# Altium schematic sheet ADC-Peripherals.SchDoc: <SPECIFIC SHEET FUNCTION>
size A3; Date: DO NOT USE, RATHER USE PROJ OPTIONS; DrawnBy: DO NOT USE, RATHER USE PROJ OPTIONS; Engineer: DO NOT USE, RATHER USE PROJ OPTIONS; Organization: DO NOT USE, RATHER USE PROJ OPTIONS; DocumentNumber: 5; Revision: DO NOT USE, RATHER USE PROJ OPTIONS; SheetNumber: 5; SheetTotal: 12; SCH_Sheet_Filename: ADC-Peripherals.SchDoc; CurrentTime: DO NOT USE, RATHER USE PROJ OPTIONS; Time: DO NOT USE, RATHER USE PROJ OPTIONS; DocumentFullPathAndName: DO NOT USE, RATHER USE PROJ OPTIONS; DocumentName: DO NOT USE, RATHER USE PROJ OPTIONS; ModifiedDate: DO NOT USE, RATHER USE PROJ OPTIONS; ImagePath: DO NOT USE, RATHER USE PROJ OPTIONS
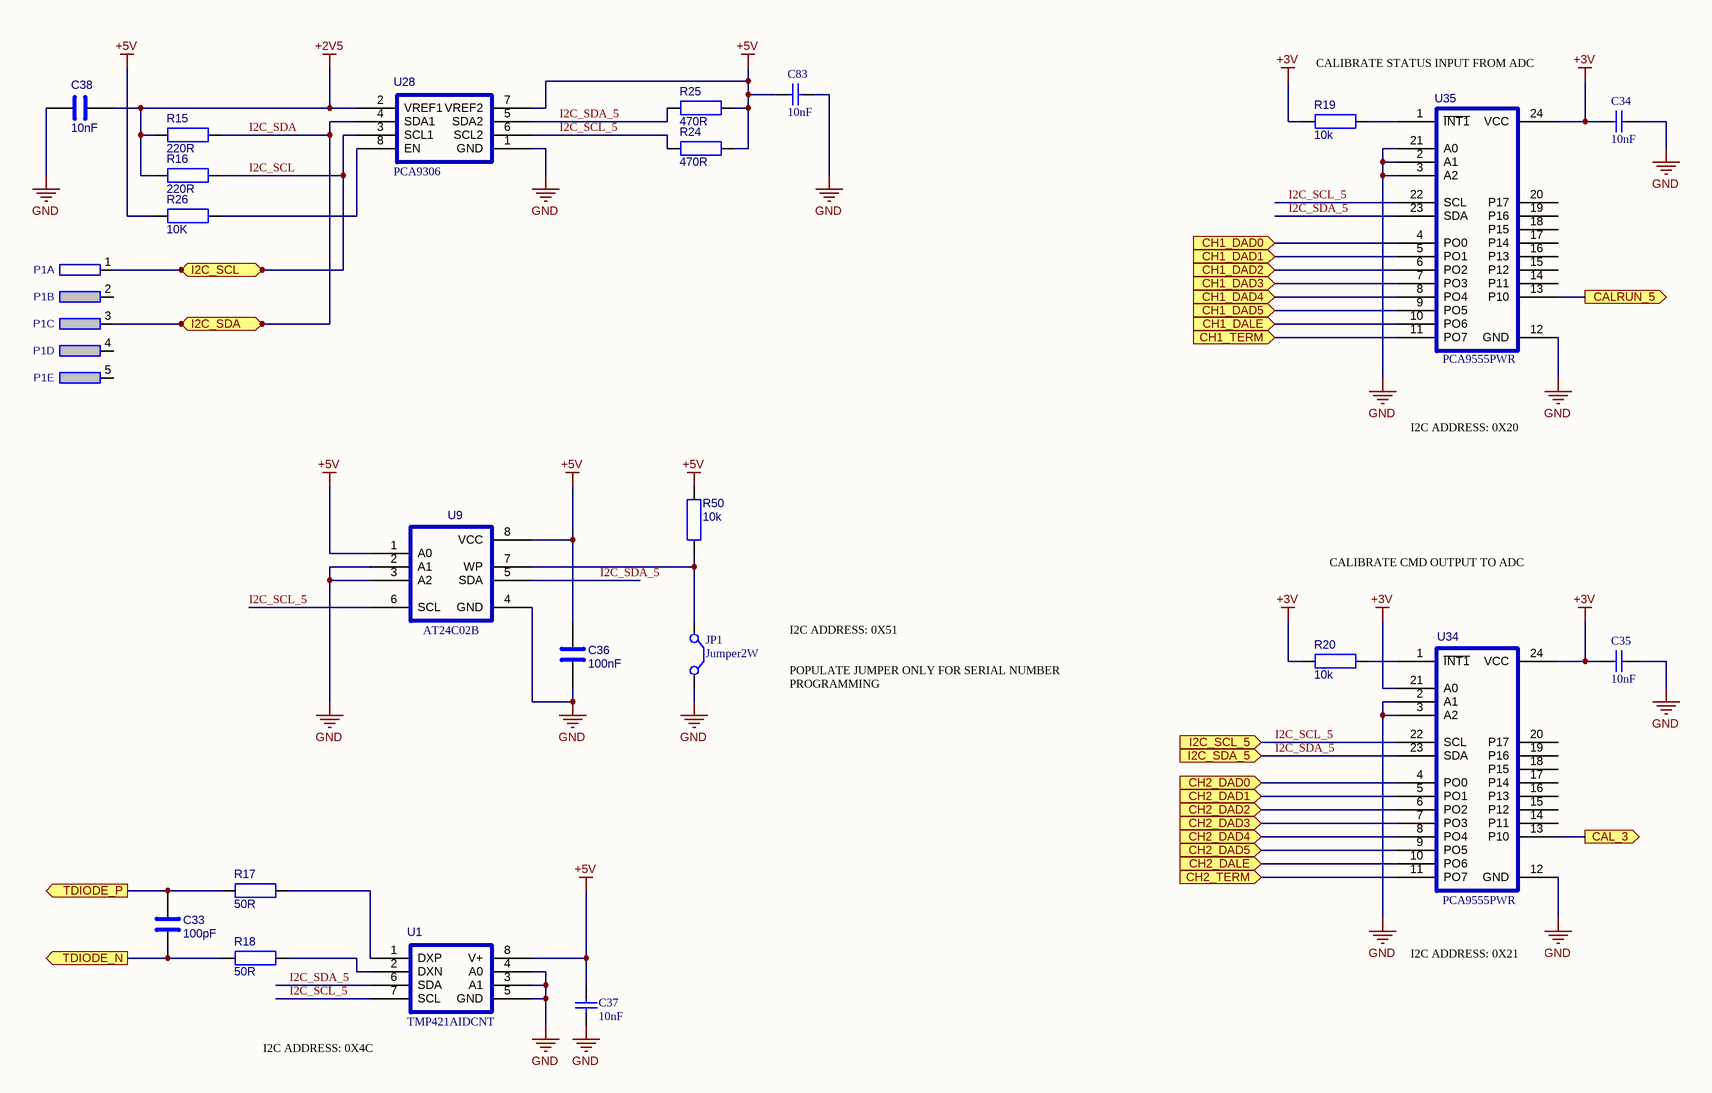
[diagram p0: ADC-Peripherals.SchDoc]

## Parts
C33  value 100pF  [CAPC1005X55N]  (hidden comment: *)
C34  value 10nF  [CAPC1005X55N]  (hidden comment: Capacitor 0402 SMD)
C35  value 10nF  [CAPC1005X55N]  (hidden comment: Capacitor 0402 SMD)
C36  100nF  [CAPC1005X55N]
C37  value 10nF  [CAPC1005X55N]  (hidden comment: Capacitor 0402 SMD)
C38  10nF  [CAPC1005X55N]
C83  value 10nF  [CAPC1005X55N]  (hidden comment: Capacitor 0402 SMD)
JP1  Jumper2W  [JP-100MIL]
P1  SAMTEC-TSM-105-01-TM-SV-5W-HDR  [TSM_5X1_SV]  (value not drawn)  (parts A,B,C,D,E of 5)
R15  220R  [0603]
R16  220R  [0603]
R17  value 50R  [RESC1005X40N]  (hidden comment: *)
R18  50R  [RESC1005X40N]
R19  10k  [0603]
R20  10k  [0603]
R24  470R  [0603]
R25  470R  [0603]
R26  10K  [0603]
R50  value 10k  [0603]  (hidden comment: *)
U1  TMP421AIDCNT  [TI_SOT23-8]
U9  AT24C02B  [SOIC127P600X175-8N]
U28  PCA9306  [SOP65P400X130-8USR]
U34  PCA9555PWR  [TI_TSSOP24]
U35  PCA9555PWR  [TI_TSSOP24]

## Ports
CAL_3 (out), CALRUN_5 (out), CH1_DAD0 (in), CH1_DAD1 (in), CH1_DAD2 (in), CH1_DAD3 (in), CH1_DAD4 (in), CH1_DAD5 (in), CH1_DALE (in), CH1_TERM (in), CH2_DAD0 (in), CH2_DAD1 (in), CH2_DAD2 (in), CH2_DAD3 (in), CH2_DAD4 (in), CH2_DAD5 (in), CH2_DALE (in), CH2_TERM (in), I2C_SCL, I2C_SCL_5 (in), I2C_SDA, I2C_SDA_5 (in), TDIODE_N (out), TDIODE_P (out)

## Nets
+2V5: C38.2 R15.1 R16.1 U28.2(VREF1)
+3V: C34.1 C35.1 R19.1 R20.1 U34.21(A0) U34.24(VCC) U35.24(VCC)
+5V: C36.1 C37.2 C83.1 R24.2 R25.2 R26.2 R50.1 U1.8(V+) U9.1(A0) U9.8(VCC) U28.7(VREF2)
GND: C34.2 C35.2 C36.2 C37.1 C38.1 C83.2 JP1.2(C2) U1.3(A1) U1.4(A0) U1.5(GND) U9.2(A1) U9.3(A2) U9.4(GND) U28.1(GND) U34.2(A1) U34.3(A2) U34.12(GND) U35.2(A1) U35.3(A2) U35.12(GND) U35.21(A0)
CAL_3: U34.13(P10) ; port CAL_3
CALRUN_5: U35.13(P10) ; port CALRUN_5
CH1_DAD0: U35.4(PO0) ; port CH1_DAD0
CH1_DAD1: U35.5(PO1) ; port CH1_DAD1
CH1_DAD2: U35.6(PO2) ; port CH1_DAD2
CH1_DAD3: U35.7(PO3) ; port CH1_DAD3
CH1_DAD4: U35.8(PO4) ; port CH1_DAD4
CH1_DAD5: U35.9(PO5) ; port CH1_DAD5
CH1_DALE: U35.10(PO6) ; port CH1_DALE
CH1_TERM: U35.11(PO7) ; port CH1_TERM
CH2_DAD0: U34.4(PO0) ; port CH2_DAD0
CH2_DAD1: U34.5(PO1) ; port CH2_DAD1
CH2_DAD2: U34.6(PO2) ; port CH2_DAD2
CH2_DAD3: U34.7(PO3) ; port CH2_DAD3
CH2_DAD4: U34.8(PO4) ; port CH2_DAD4
CH2_DAD5: U34.9(PO5) ; port CH2_DAD5
CH2_DALE: U34.10(PO6) ; port CH2_DALE
CH2_TERM: U34.11(PO7) ; port CH2_TERM
I2C_SCL: P1.1 R16.2 U28.3(SCL1) ; port I2C_SCL
I2C_SCL_5: R24.1 U1.7(SCL) U9.6(SCL) U28.6(SCL2) U34.22(SCL) U35.22(SCL) ; port I2C_SCL_5
I2C_SDA: P1.3 R15.2 U28.4(SDA1) ; port I2C_SDA
I2C_SDA_5: R25.1 U1.6(SDA) U9.5(SDA) U28.5(SDA2) U34.23(SDA) U35.23(SDA) ; port I2C_SDA_5
TDIODE_N: C33.2 R18.2 ; port TDIODE_N
TDIODE_P: C33.1 R17.2 ; port TDIODE_P
NetJP1_1: JP1.1(C1) R50.2 U9.7(WP)
NetR17_1: R17.1 U1.1(DXP)
NetR18_1: R18.1 U1.2(DXN)
NetR19_2: R19.2 U35.1(~{INT1})
NetR20_2: R20.2 U34.1(~{INT1})
NetR26_1: R26.1 U28.8(EN)

Not connected (* = marked no-connect by the designer): P1 2 4 5; U34 14(P11) 15(P12) 16(P13) 17(P14) 18(P15) 19(P16) 20(P17); U35 14(P11) 15(P12) 16(P13) 17(P14) 18(P15) 19(P16) 20(P17)

## Notes on the sheet
- CALIBRATE STATUS INPUT FROM ADC
- I2C ADDRESS: 0X20
- CALIBRATE CMD OUTPUT TO ADC
- I2C ADDRESS: 0X51
- POPULATE JUMPER ONLY FOR SERIAL NUMBER PROGRAMMING
- I2C ADDRESS: 0X21
- (near U1) I2C ADDRESS: 0X4C
- 2009   THIS DOCUMENT IS THE PROPERTY OF THE OWNER, AND MAY NOT BE COPIED OR USED FOR ANY PURPOSE OTHER THAN THAT FOR WHICH IT IS SUPPLIED WITHOUT PERMISSION IN WRITING FROM THE OWNER.
- C
- DATESTAMP OF THIS PRINT
- DRAWN BY:
- DOCUMENT NUMBER:
- SCHEMATIC FILENAME:
- PCB FILENAME:
- ENGINEER:
- APPROVED:
- CIRCUIT DIAGRAM
- DATE
- SHEET
- REVISION
- OF

## Library data of the parts
C33 C36 C38 = CAP-0603: CAP SMD 0603; Manufacturer: *; Manufacturer_PN: *; Created_By: *; Checked_By: *; Checked_Date: *; HelpURL: *; ComponentLink1Description: Footprint Detail; ComponentLink1URL: *; ComponentLink2Description: Application Note; ComponentLink2URL: *; ComponentLink3Description: Layout Guidelines; ComponentLink3URL: *; ComponentLink4Description: Technology Reference; ComponentLink4URL: *; Supplier1: *; Supplier2: *; Unit_Cost: *; MOQ: *; Leadtime: *; Inventory_Stock: *; Tolerance: *; Wattage: *; Voltage: *; Package: 0603; ComponentLink5Description: Production Detail; ComponentLink5URL: *; Note: *; Stock Code: *
  C36: Value: 100nF
  C38: Value: 10nF
C34 C35 C37 C83 = cap0402: Created_By: EDA-ASA; Checked_By: *; Checked_Date: *; HelpURL: *; Supplier1: *; Supplier2: *; Unit_Cost: *; MOQ: *; Leadtime: *; Inventory_Stock: *; Tolerance: *; Wattage: *; Package: 0402; ComponentLinked1Description: *; ComponentLinked1URL: *; ComponentLinked2Description: *; ComponentLinked2URL: *; ComponentLinked3Description: *; ComponentLinked3URL: *; ComponentLinked4Description: *; ComponentLinked4URL: *
JP1 = Jumper2W: Jumper Wire; Published: 24-Mar-1999; LatestRevisionDate: 17-Jul-2002; LatestRevisionNote: Re-released for DXP Platform.; PackageReference: RAD-0.2; Publisher: Altium Limited
P1 = SAMTEC-TSM-105-01-TM-SV-5W-HDR: Value: {Value}
R15-R20 R24-R26 R50 = RES-0805: RESISTOR SMD 0805; Checked_By: NN; Manufacturer: *; Manufacturer_PN: *; Created_By: *; Checked_Date: 5-08-2009; HelpURL: *; ComponentLink1Description: Footprint Detail; ComponentLink1URL: *; ComponentLink2Description: Application Note; ComponentLink2URL: *; ComponentLink3Description: Layout Guidelines; ComponentLink3URL: *; ComponentLink4Description: Technology Reference; ComponentLink4URL: *; Supplier1: *; Supplier2: *; Unit_Cost: *; MOQ: *; Leadtime: *; Inventory_Stock: *; Tolerance: *; Wattage: *; Voltage: *; Package: 0805; ComponentLink5Description: Production Detail; ComponentLink5URL: *; Note: *; Stock Code: *
  R15 R16: Value: 220R
  R18: Value: 50R
  R19 R20: Value: 10k
  R24 R25: Value: 470R
  R26: Value: 10K
U1 = TMP421AIDCNT: Remote and Local TempreatureSensor in SOT23-8; Manufacturer: TI; Manufacturer_PN: TMP421AIDCNT; Created_By: IN; Checked_By: *; Checked_Date: *; HelpURL: X:Datasheets\By_Manufacturer\TI\tmp421.pdf; ComponentLink1Description: Footprint Detail; ComponentLink1URL: X:Datasheets\By_Manufacturer\TI\tmp421.pdf; ComponentLink2Description: Application Note; ComponentLink2URL: *; ComponentLink3Description: Layout Guidelines; ComponentLink3URL: *; ComponentLink4Description: Technology Reference; ComponentLink4URL: *; Supplier1: *; Supplier2: *; Unit_Cost: *; MOQ: *; Leadtime: *; Inventory_Stock: *; Tolerance: *; Wattage: *; Voltage: *; Package: *; ComponentLink5Description: Production Detail; ComponentLink5URL: *; Note: *; Stock Code: *
U9 = AT24C02B: Two wire Serial EEPROM 2K (256 x 8); Manufacturer: Atmel; Created_By: IN; Manufacturer_PN: AT24C02B; Checked_By: *; Checked_Date: *; HelpURL: X:\Datasheets\By_Manufacturer\ATMEL\at24c02b.pdf; ComponentLink1Description: Footprint Detail; ComponentLink1URL: *; ComponentLink2Description: Application Note; ComponentLink2URL: *; ComponentLink3Description: Layout Guidelines; ComponentLink3URL: *; ComponentLink4Description: Technology Reference; ComponentLink4URL: *; Supplier1: *; Supplier2: *; Unit_Cost: *; MOQ: *; Leadtime: *; Inventory_Stock: *; Tolerance: *; Wattage: *; Voltage: *; Package: *; ComponentLink5Description: Production Detail; ComponentLink5URL: *; Note: *; Stock Code: *
U28 = PCA9306DCTR: Dual Bidirectional I2C Bus and SMBus Voltage-Level Translator; Manufacturer: TI; Created_By: IN; Manufacturer_PN: PCA9306; Checked_By: *; Checked_Date: *; HelpURL: X:\Datasheets\By_Manufacturer\TI\pca9306.pdf; ComponentLink1Description: Footprint Detail; ComponentLink1URL: *; ComponentLink2Description: Application Note; ComponentLink2URL: *; ComponentLink3Description: Layout Guidelines; ComponentLink3URL: *; ComponentLink4Description: Technology Reference; ComponentLink4URL: *; Supplier1: *; Supplier2: *; Unit_Cost: *; MOQ: *; Leadtime: *; Inventory_Stock: *; Tolerance: *; Wattage: *; Voltage: *; Package: *; ComponentLink5Description: Production Detail; ComponentLink5URL: *; Note: *; Stock Code: *
U34 U35 = PCA9555PWR: Remote 16-Bit I2C and SMBus  I/O expander; Manufacturer: TI; Created_By: IN; Manufacturer_PN: PCA9555PWR; Checked_By: *; Checked_Date: *; HelpURL: X:\Datasheets\By_Manufacturer\TI\pca9555.pdf; ComponentLink1Description: X:\Datasheets\By_Manufacturer\TI\pca9555.pdf#page=22; ComponentLink1URL: *; ComponentLink2Description: Application Note; ComponentLink2URL: *; ComponentLink3Description: Layout Guidelines; ComponentLink3URL: *; ComponentLink4Description: Technology Reference; ComponentLink4URL: *; Supplier1: *; Supplier2: *; Unit_Cost: *; MOQ: *; Leadtime: *; Inventory_Stock: *; Tolerance: *; Wattage: *; Voltage: *; Package: *; ComponentLink5Description: Production Detail; ComponentLink5URL: *; Note: *; Stock Code: *